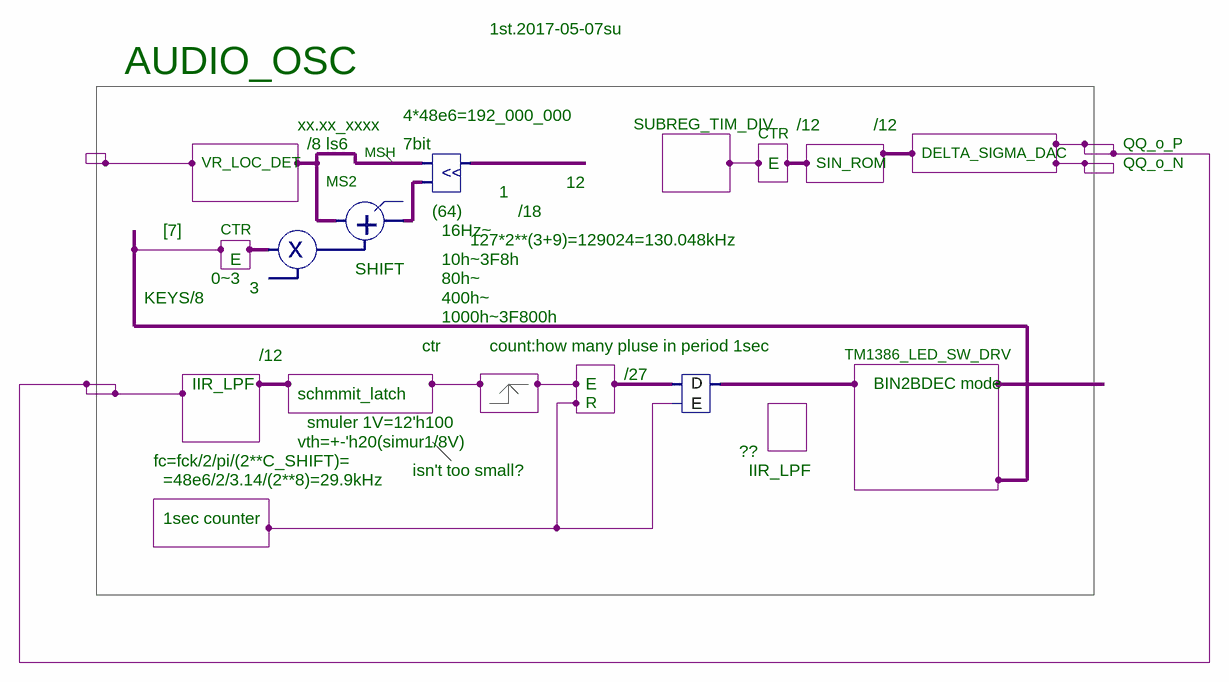
[diagram p0: schematic sheet]
// Quartus schematic chart.bdf as structural Verilog: 4 symbols, 0 pins
module chart (
);

  wire undriven_3;
  wire [7:0] inst1_y, inst2_y, inst3_y, inst_y, undriven, undriven_2;

  mul inst1 (.A(undriven), .Y(inst1_y));  // open: B
  add inst3 (.A(undriven_2), .B(inst1_y), .Y(inst3_y));  // open: cy
  sfl inst2 (.D(undriven_2), .E(inst3_y), .Y(inst2_y));
  DE inst (.D(undriven_3), .E(undriven_3), .Y(inst_y));

  // Notes on the sheet:
  //   1st.2017-05-07su
  //   AUDIO_OSC
  //   4*48e6=192_000_000
  //   xx.xx_xxxx
  //   SUBREG_TIM_DIV
  //   /12
  //   /12
  //   CTR
  //   /8
  //   ls6
  //   7bit
  //   QQ_o_P
  //   MSH
  //   DELTA_SIGMA_DAC
  //   VR_LOC_DET
  //   E
  //   SIN_ROM
  //   QQ_o_N
  //   MS2
  //   12
  //   1
  //   (64)
  //   /18
  //   [7]
  //   CTR
  //   16Hz~
  //   127*2**(3+9)=129024=130.048kHz
  //   E
  //   10h~3F8h
  //   SHIFT
  //   0~3
  //   80h~
  //   3
  //   KEYS/8
  //   400h~
  //   1000h~3F800h
  //   ctr
  //   count:how many pluse in period 1sec
  //   /12
  //   TM1386_LED_SW_DRV
  //   /27
  //   IIR_LPF
  //   E
  //   BIN2BDEC mode
  //   schmmit_latch
  //   R
  //   smuler 1V=12'h100
  //   vth=+-'h20(simur1/8V)
  //   ??
  //   fc=fck/2/pi/(2**C_SHIFT)=
  //   isn't too small?
  //   IIR_LPF
  //   =48e6/2/3.14/(2**8)=29.9kHz
  //   1sec counter
endmodule
